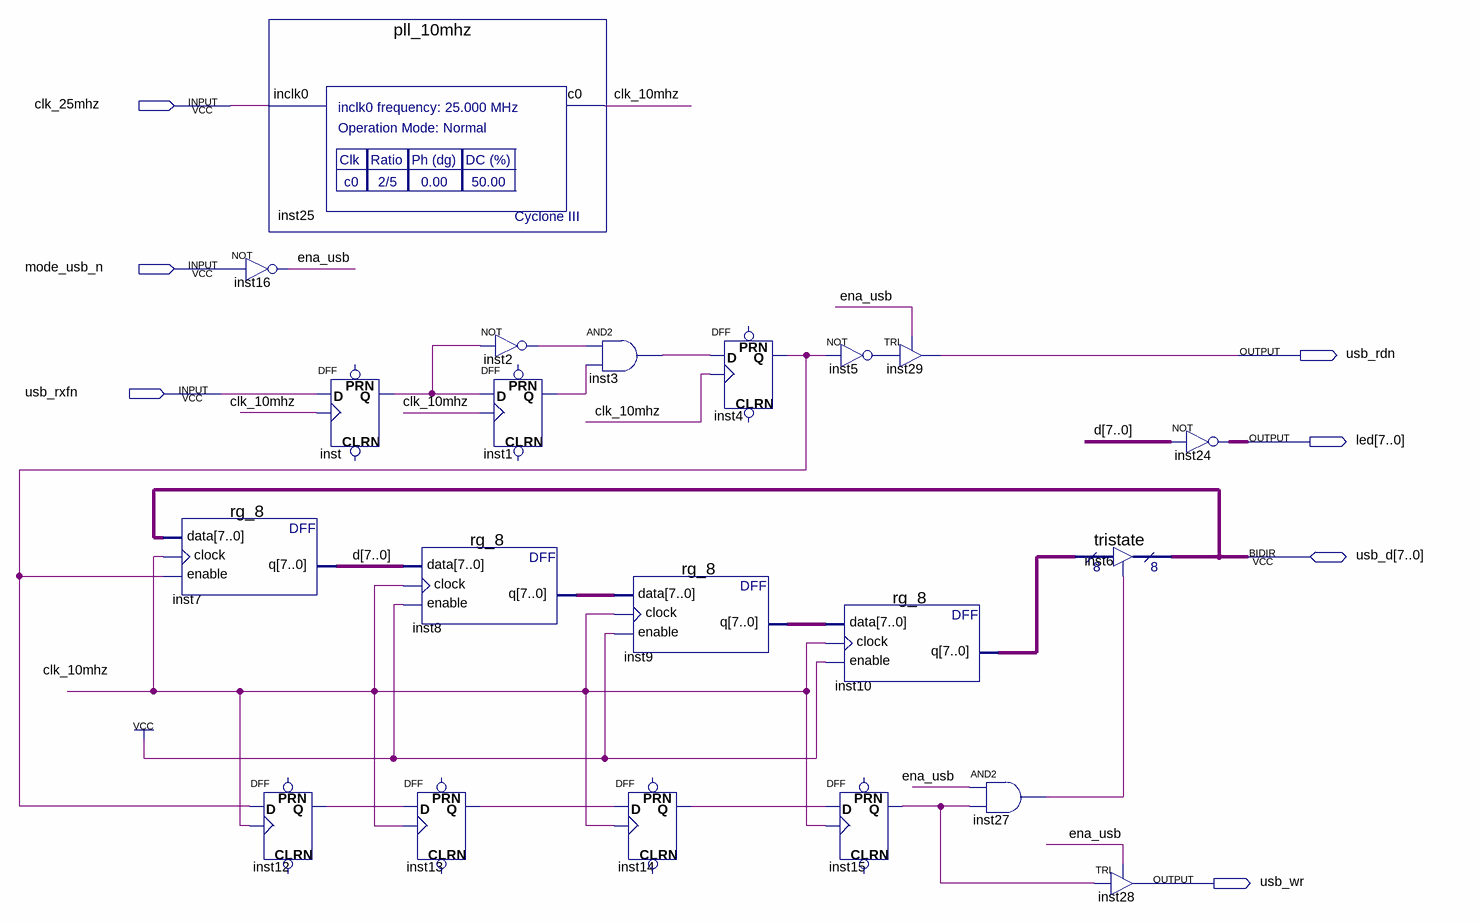
[diagram p0: schematic sheet]
// Quartus schematic test3.bdf as structural Verilog: 21 symbols, 7 pins
module test3 (
  input  clk_25mhz,
  input  mode_usb_n,
  input  usb_rxfn,
  inout  [7:0] usb_d,
  output usb_rdn,
  output [7:0] led,
  output usb_wr
);

  wire clk_10mhz, ena_usb, inst1_q, inst2_out, inst3_out, inst4_q, inst5_out, inst12_q, inst13_q, inst14_q,
       inst15_q, inst27_out, inst_q;
  wire [7:0] d, inst8_q, inst9_q, inst10_q;

  rg_8 inst7 (.data(usb_d), .clock(clk_10mhz), .enable(inst4_q), .q(d));
  not inst16 (ena_usb, mode_usb_n);
  DFF inst12 (.CLK(clk_10mhz), .D(inst4_q), .Q(inst12_q));  // open: CLRN, PRN
  pll_10mhz inst25 (.inclk0(clk_25mhz), .c0(clk_10mhz));
  DFF inst (.CLK(clk_10mhz), .D(usb_rxfn), .Q(inst_q));  // open: CLRN, PRN
  rg_8 inst8 (.data(d), .clock(clk_10mhz), .enable(1'b1), .q(inst8_q));
  DFF inst13 (.CLK(clk_10mhz), .D(inst12_q), .Q(inst13_q));  // open: CLRN, PRN
  not inst2 (inst2_out, inst_q);
  DFF inst1 (.CLK(clk_10mhz), .D(inst_q), .Q(inst1_q));  // open: CLRN, PRN
  and inst3 (inst3_out, inst2_out, inst1_q);
  rg_8 inst9 (.data(inst8_q), .clock(clk_10mhz), .enable(1'b1), .q(inst9_q));
  DFF inst14 (.CLK(clk_10mhz), .D(inst13_q), .Q(inst14_q));  // open: CLRN, PRN
  DFF inst4 (.CLK(clk_10mhz), .D(inst3_out), .Q(inst4_q));  // open: CLRN, PRN
  not inst5 (inst5_out, inst4_q);
  rg_8 inst10 (.data(inst9_q), .clock(clk_10mhz), .enable(1'b1), .q(inst10_q));
  DFF inst15 (.CLK(clk_10mhz), .D(inst14_q), .Q(inst15_q));  // open: CLRN, PRN
  TRI inst29 (.IN(inst5_out), .OE(ena_usb), .OUT(usb_rdn));
  and inst27 (inst27_out, ena_usb, inst15_q);
  tristate inst6 (.enabledt(inst27_out), .data(inst10_q), .tridata(usb_d));
  TRI inst28 (.IN(inst15_q), .OE(ena_usb), .OUT(usb_wr));
  assign led = ~d;  // NOT inst24, 8 bits wide
endmodule
